# Altium schematic sheet TestMod_SEAx_Base.SchDoc
size A3
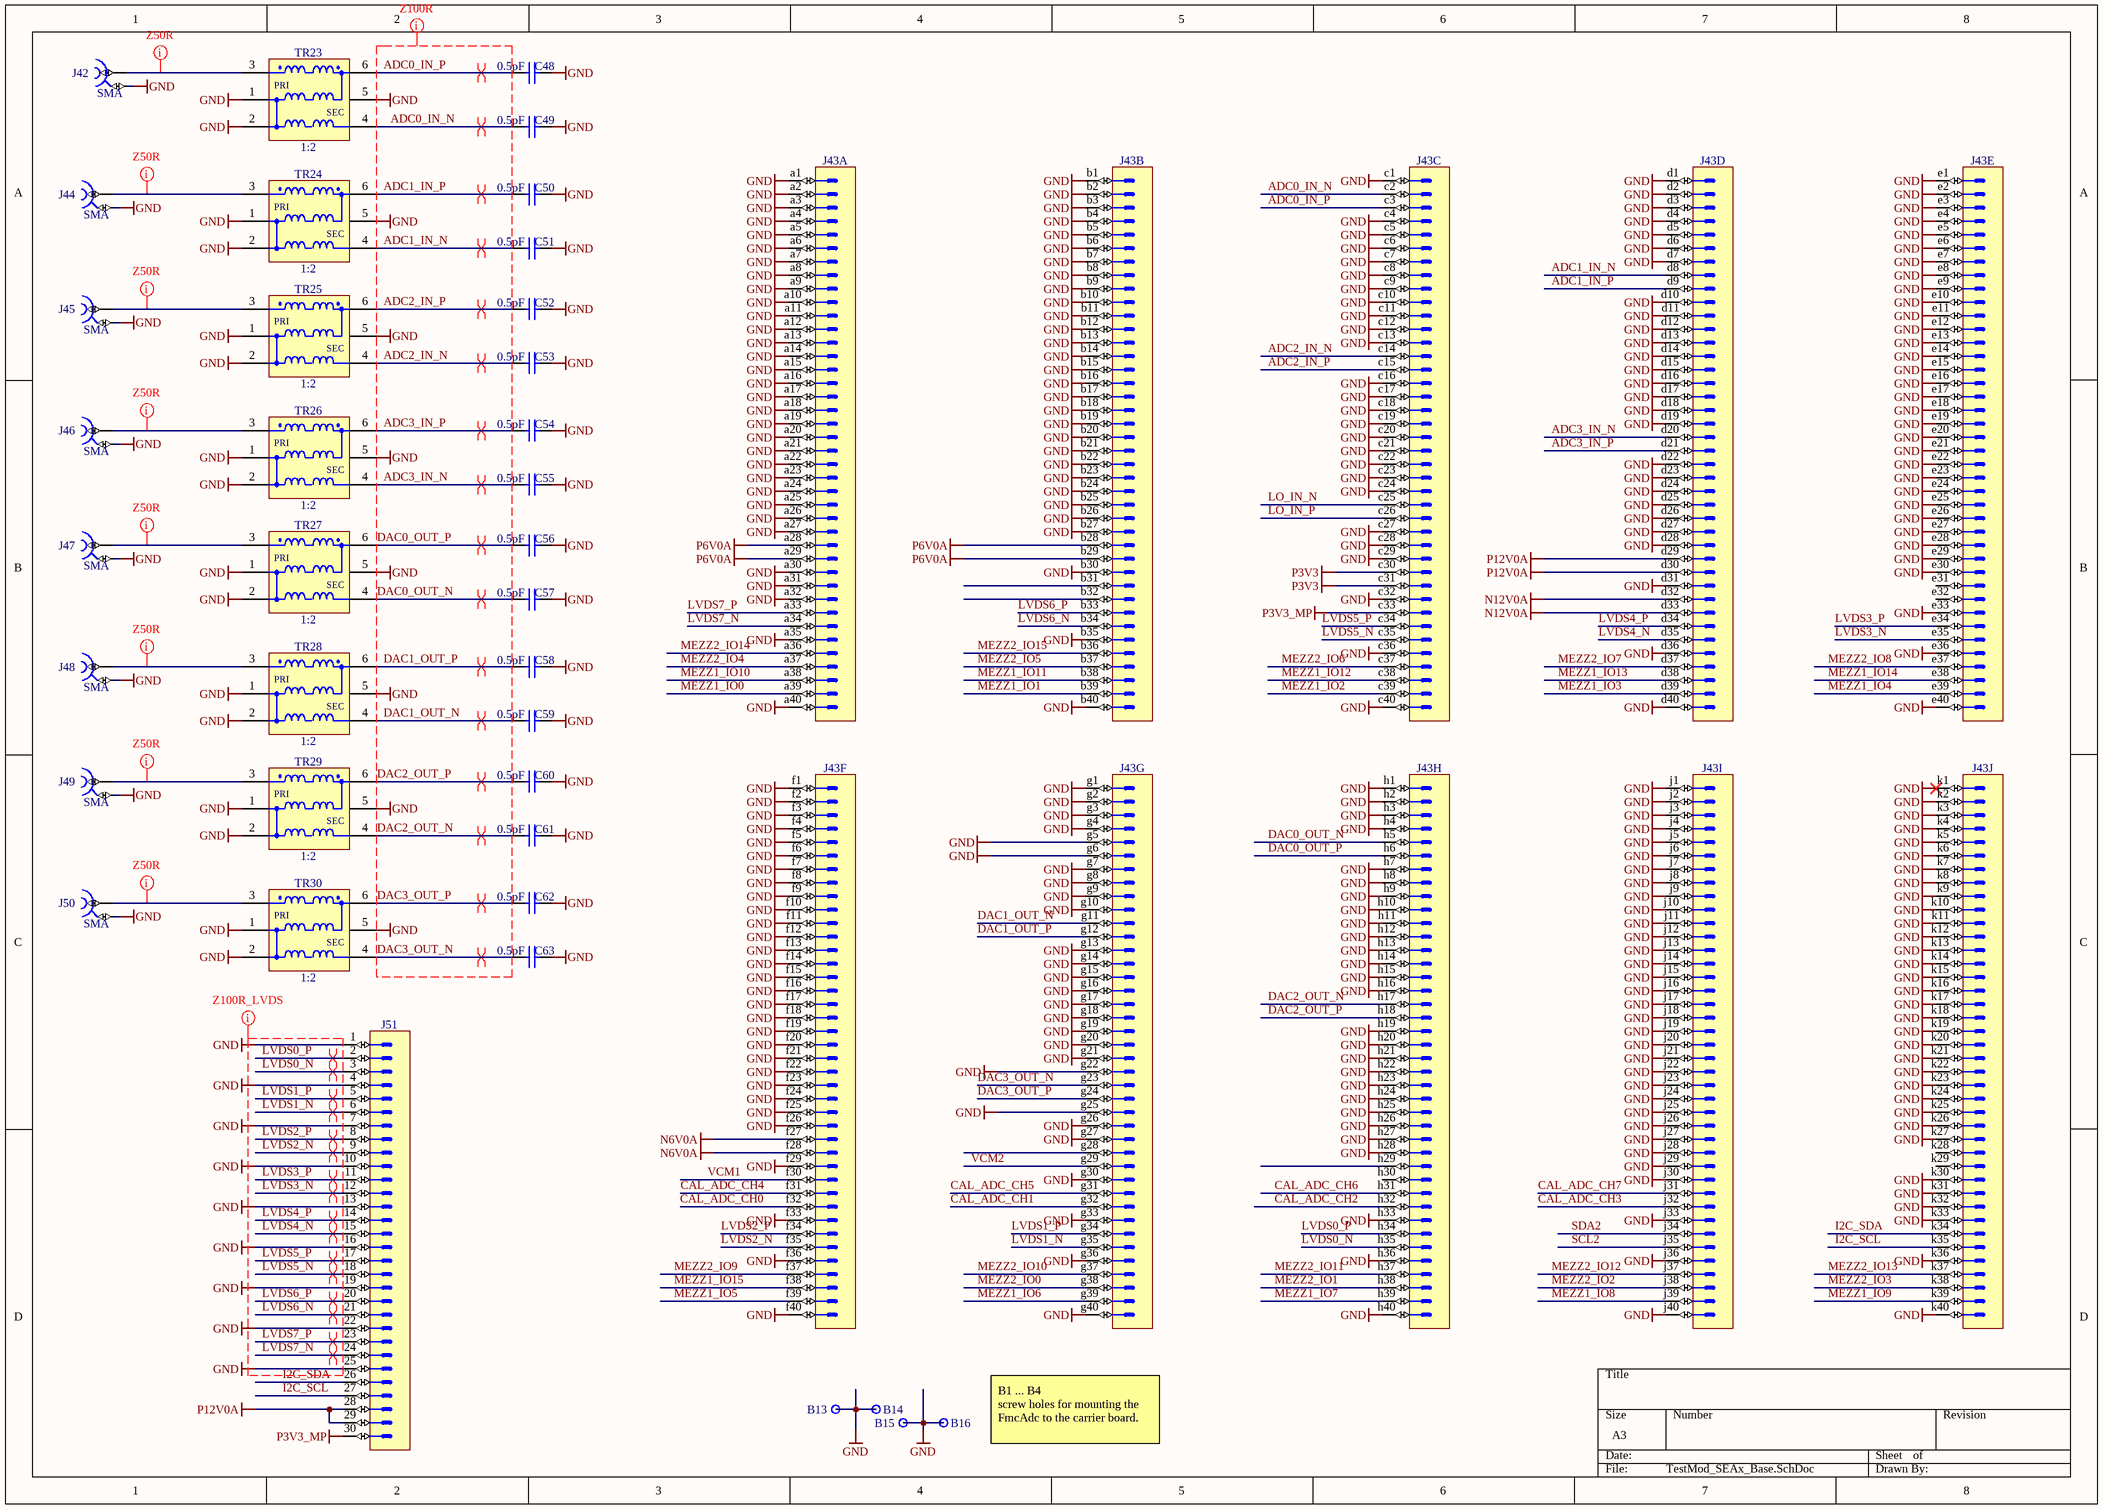
[diagram p0: TestMod_SEAx_Base.SchDoc]

## Parts
B13  Plated Hole  [MTG270_500]  (value not drawn)
B14  Plated Hole  [MTG270_500]  (value not drawn)
B15  Plated Hole  [MTG270_500]  (value not drawn)
B16  Plated Hole  [MTG270_500]  (value not drawn)
C48  0.5pF  [CAPC1005X50N]
C49  0.5pF  [CAPC1005X50N]
C50  0.5pF  [CAPC1005X50N]
C51  0.5pF  [CAPC1005X50N]
C52  0.5pF  [CAPC1005X50N]
C53  0.5pF  [CAPC1005X50N]
C54  0.5pF  [CAPC1005X50N]
C55  0.5pF  [CAPC1005X50N]
C56  0.5pF  [CAPC1005X50N]
C57  0.5pF  [CAPC1005X50N]
C58  0.5pF  [CAPC1005X50N]
C59  0.5pF  [CAPC1005X50N]
C60  0.5pF  [CAPC1005X50N]
C61  0.5pF  [CAPC1005X50N]
C62  0.5pF  [CAPC1005X50N]
C63  0.5pF  [CAPC1005X50N]
J42  SMA  [TYCO_5-1814832-1]
J43  VITA 57  [SAMTEC_ASP-134488-01]  (value not drawn)  (parts A,B,C,D,E,F,G,H,I,J of 10)
J44  SMA  [TYCO_5-1814832-1]
J45  SMA  [TYCO_5-1814832-1]
J46  SMA  [TYCO_5-1814832-1]
J47  SMA  [TYCO_5-1814832-1]
J48  SMA  [TYCO_5-1814832-1]
J49  SMA  [TYCO_5-1814832-1]
J50  SMA  [TYCO_5-1814832-1]
J51  (no value)  [3M_N2530-6002RB]
TR23  1:2  [XFMR_MINI-CIRCUITS_DB1627]
TR24  1:2  [XFMR_MINI-CIRCUITS_DB1627]
TR25  1:2  [XFMR_MINI-CIRCUITS_DB1627]
TR26  1:2  [XFMR_MINI-CIRCUITS_DB1627]
TR27  1:2  [XFMR_MINI-CIRCUITS_DB1627]
TR28  1:2  [XFMR_MINI-CIRCUITS_DB1627]
TR29  1:2  [XFMR_MINI-CIRCUITS_DB1627]
TR30  1:2  [XFMR_MINI-CIRCUITS_DB1627]

## Nets
GND: B13.1 B14.1 B15.1 B16.1 C48.2 C49.2 C50.2 C51.2 C52.2 C53.2 C54.2 C55.2 C56.2 C57.2 C58.2 C59.2 C60.2 C61.2 C62.2 C63.2 J42.2 J43.a1 J43.a2 J43.a3 J43.a4 J43.a5 J43.a6 J43.a7 J43.a8 J43.a9 J43.a10 J43.a11 J43.a12 J43.a13 J43.a14 J43.a15 J43.a16 J43.a17 J43.a18 J43.a19 J43.a20 J43.a21 J43.a22 J43.a23 J43.a24 J43.a25 J43.a26 J43.a27 J43.a30 J43.a31 J43.a32 J43.a35 J43.a40 J43.b1 J43.b2 J43.b3 J43.b4 J43.b5 J43.b6 J43.b7 J43.b8 J43.b9 J43.b10 J43.b11 J43.b12 J43.b13 J43.b14 J43.b15 J43.b16 J43.b17 J43.b18 J43.b19 J43.b20 J43.b21 J43.b22 J43.b23 J43.b24 J43.b25 J43.b26 J43.b27 J43.b30 J43.b35 J43.b40 J43.c1 J43.c4 J43.c5 J43.c6 J43.c7 J43.c8 J43.c9 J43.c10 J43.c11 J43.c12 J43.c13 J43.c16 J43.c17 J43.c18 J43.c19 J43.c20 J43.c21 J43.c22 J43.c23 J43.c24 J43.c27 J43.c28 J43.c29 J43.c32 J43.c36 J43.c40 J43.d1 J43.d2 J43.d3 J43.d4 J43.d5 J43.d6 J43.d7 J43.d10 J43.d11 J43.d12 J43.d13 J43.d14 J43.d15 J43.d16 J43.d17 J43.d18 J43.d19 J43.d22 J43.d23 J43.d24 J43.d25 J43.d26 J43.d27 J43.d28 J43.d31 J43.d36 J43.d40 J43.e1 J43.e2 J43.e3 J43.e4 J43.e5 J43.e6 J43.e7 J43.e8 J43.e9 J43.e10 J43.e11 J43.e12 J43.e13 J43.e14 J43.e15 J43.e16 J43.e17 J43.e18 J43.e19 J43.e20 J43.e21 J43.e22 J43.e23 J43.e24 J43.e25 J43.e26 J43.e27 J43.e28 J43.e29 J43.e30 J43.e33 J43.e36 J43.e40 J43.f1 J43.f2 J43.f3 J43.f4 J43.f5 J43.f6 J43.f7 J43.f8 J43.f9 J43.f10 J43.f11 J43.f12 J43.f13 J43.f14 J43.f15 J43.f16 J43.f17 J43.f18 J43.f19 J43.f20 J43.f21 J43.f22 J43.f23 J43.f24 J43.f25 J43.f26 J43.f29 J43.f33 J43.f36 J43.f40 J43.g1 J43.g2 J43.g3 J43.g4 J43.g5 J43.g6 J43.g7 J43.g8 J43.g9 J43.g10 J43.g13 J43.g14 J43.g15 J43.g16 J43.g17 J43.g18 J43.g19 J43.g20 J43.g21 J43.g22 J43.g25 J43.g26 J43.g27 J43.g30 J43.g33 J43.g36 J43.g40 J43.h1 J43.h2 J43.h3 J43.h4 J43.h7 J43.h8 J43.h9 J43.h10 J43.h11 J43.h12 J43.h13 J43.h14 J43.h15 J43.h16 J43.h19 J43.h20 J43.h21 J43.h22 J43.h23 J43.h24 J43.h25 J43.h26 J43.h27 J43.h28 J43.h33 J43.h36 J43.h40 J43.j1 J43.j2 J43.j3 J43.j4 J43.j5 J43.j6 J43.j7 J43.j8 J43.j9 J43.j10 J43.j11 J43.j12 J43.j13 J43.j14 J43.j15 J43.j16 J43.j17 J43.j18 J43.j19 J43.j20 J43.j21 J43.j22 J43.j23 J43.j24 J43.j25 J43.j26 J43.j27 J43.j28 J43.j29 J43.j30 J43.j33 J43.j36 J43.j40 J43.k1 J43.k2 J43.k3 J43.k4 J43.k5 J43.k6 J43.k7 J43.k8 J43.k9 J43.k10 J43.k11 J43.k12 J43.k13 J43.k14 J43.k15 J43.k16 J43.k17 J43.k18 J43.k19 J43.k20 J43.k21 J43.k22 J43.k23 J43.k24 J43.k25 J43.k26 J43.k27 J43.k30 J43.k31 J43.k32 J43.k33 J43.k36 J43.k40 J44.2 J45.2 J46.2 J47.2 J48.2 J49.2 J50.2 J51.1 J51.4 J51.7 J51.10 J51.13 J51.16 J51.19 J51.22 J51.25 TR23.1(P1) TR23.2(P1) TR23.5(NC) TR24.1(P1) TR24.2(P1) TR24.5(NC) TR25.1(P1) TR25.2(P1) TR25.5(NC) TR26.1(P1) TR26.2(P1) TR26.5(NC) TR27.1(P1) TR27.2(P1) TR27.5(NC) TR28.1(P1) TR28.2(P1) TR28.5(NC) TR29.1(P1) TR29.2(P1) TR29.5(NC) TR30.1(P1) TR30.2(P1) TR30.5(NC)
N6V0A: J43.f27 J43.f28
N12V0A: J43.d32 J43.d33
P3V3: J43.c30 J43.c31
P3V3_MP: J43.c33 J51.30
P6V0A: J43.a28 J43.a29 J43.b28 J43.b29
P12V0A: J43.d29 J43.d30 J51.28 J51.29
ADC0_IN_N: C49.1 J43.c2 TR23.4(S1)
ADC0_IN_P: C48.1 J43.c3 TR23.6(S1)
ADC1_IN_N: C51.1 J43.d8 TR24.4(S1)
ADC1_IN_P: C50.1 J43.d9 TR24.6(S1)
ADC2_IN_N: C53.1 J43.c14 TR25.4(S1)
ADC2_IN_P: C52.1 J43.c15 TR25.6(S1)
ADC3_IN_N: C55.1 J43.d20 TR26.4(S1)
ADC3_IN_P: C54.1 J43.d21 TR26.6(S1)
CAL_ADC_CH0: J43.f32
CAL_ADC_CH1: J43.g32
CAL_ADC_CH2: J43.h32
CAL_ADC_CH3: J43.j32
CAL_ADC_CH4: J43.f31
CAL_ADC_CH5: J43.g31
CAL_ADC_CH6: J43.h31
CAL_ADC_CH7: J43.j31
DAC0_OUT_N: C57.1 J43.h5 TR27.4(S1)
DAC0_OUT_P: C56.1 J43.h6 TR27.6(S1)
DAC1_OUT_N: C59.1 J43.g11 TR28.4(S1)
DAC1_OUT_P: C58.1 J43.g12 TR28.6(S1)
DAC2_OUT_N: C61.1 J43.h17 TR29.4(S1)
DAC2_OUT_P: C60.1 J43.h18 TR29.6(S1)
DAC3_OUT_N: C63.1 J43.g23 TR30.4(S1)
DAC3_OUT_P: C62.1 J43.g24 TR30.6(S1)
I2C_SCL: J43.k35 J51.27
I2C_SDA: J43.k34 J51.26
LO_IN_N: J43.c25
LO_IN_P: J43.c26
LVDS0_N: J43.h35 J51.3
LVDS0_P: J43.h34 J51.2
LVDS1_N: J43.g35 J51.6
LVDS1_P: J43.g34 J51.5
LVDS2_N: J43.f35 J51.9
LVDS2_P: J43.f34 J51.8
LVDS3_N: J43.e35 J51.12
LVDS3_P: J43.e34 J51.11
LVDS4_N: J43.d35 J51.15
LVDS4_P: J43.d34 J51.14
LVDS5_N: J43.c35 J51.18
LVDS5_P: J43.c34 J51.17
LVDS6_N: J43.b34 J51.21
LVDS6_P: J43.b33 J51.20
LVDS7_N: J43.a34 J51.24
LVDS7_P: J43.a33 J51.23
MEZZ1_IO0: J43.a39
MEZZ1_IO1: J43.b39
MEZZ1_IO2: J43.c39
MEZZ1_IO3: J43.d39
MEZZ1_IO4: J43.e39
MEZZ1_IO5: J43.f39
MEZZ1_IO6: J43.g39
MEZZ1_IO7: J43.h39
MEZZ1_IO8: J43.j39
MEZZ1_IO9: J43.k39
MEZZ1_IO10: J43.a38
MEZZ1_IO11: J43.b38
MEZZ1_IO12: J43.c38
MEZZ1_IO13: J43.d38
MEZZ1_IO14: J43.e38
MEZZ1_IO15: J43.f38
MEZZ2_IO0: J43.g38
MEZZ2_IO1: J43.h38
MEZZ2_IO2: J43.j38
MEZZ2_IO3: J43.k38
MEZZ2_IO4: J43.a37
MEZZ2_IO5: J43.b37
MEZZ2_IO6: J43.c37
MEZZ2_IO7: J43.d37
MEZZ2_IO8: J43.e37
MEZZ2_IO9: J43.f37
MEZZ2_IO10: J43.g37
MEZZ2_IO11: J43.h37
MEZZ2_IO12: J43.j37
MEZZ2_IO13: J43.k37
MEZZ2_IO14: J43.a36
MEZZ2_IO15: J43.b36
SCL2: J43.j35
SDA2: J43.j34
VCM1: J43.f30
VCM2: J43.g29
NetJ42_1: J42.1 TR23.3(P1)
NetJ44_1: J44.1 TR24.3(P1)
NetJ45_1: J45.1 TR25.3(P1)
NetJ46_1: J46.1 TR26.3(P1)
NetJ47_1: J47.1 TR27.3(P1)
NetJ48_1: J48.1 TR28.3(P1)
NetJ49_1: J49.1 TR29.3(P1)
NetJ50_1: J50.1 TR30.3(P1)

Not connected (* = marked no-connect by the designer): J43 b31 b32 e31 e32 g28 h29 h30 k28 k29

## Layout directives
differential pair: ADC0_IN_N, ADC0_IN_P, ADC1_IN_N, ADC1_IN_P, ADC2_IN_N, ADC2_IN_P, ADC3_IN_N, ADC3_IN_P, DAC0_OUT_N, DAC0_OUT_P, DAC1_OUT_N, DAC1_OUT_P, DAC2_OUT_N, DAC2_OUT_P, DAC3_OUT_N, DAC3_OUT_P, LVDS0_N, LVDS0_P, LVDS1_N, LVDS1_P, LVDS2_N, LVDS2_P, LVDS3_N, LVDS3_P, LVDS4_N, LVDS4_P, LVDS5_N, LVDS5_P, LVDS6_N, LVDS6_P, LVDS7_N, LVDS7_P
rule Impedance Constraint [Min = 49.00    Max = 51.00    ]; net class Z50R: NetJ42_1, NetJ44_1, NetJ45_1, NetJ46_1, NetJ47_1, NetJ48_1, NetJ49_1, NetJ50_1
rule Differential Pairs Routing [Pref Gap = 12mil    Min Gap  = 12mil    Max Gap  = 12milPref Width = 14mil    Min Width  = 14mil    Max Width  = 14mil]: ADC0_IN_N, ADC0_IN_P, ADC1_IN_N, ADC1_IN_P, ADC2_IN_N, ADC2_IN_P, ADC3_IN_N, ADC3_IN_P, DAC0_OUT_N, DAC0_OUT_P, DAC1_OUT_N, DAC1_OUT_P, DAC2_OUT_N, DAC2_OUT_P, DAC3_OUT_N, DAC3_OUT_P, GND
rule Differential Pairs Routing [Pref Gap = 6mil    Min Gap  = 6mil    Max Gap  = 6milPref Width = 11mil    Min Width  = 11mil    Max Width  = 11mil]: GND, LVDS0_N, LVDS0_P, LVDS1_N, LVDS1_P, LVDS2_N, LVDS2_P, LVDS3_N, LVDS3_P, LVDS4_N, LVDS4_P, LVDS5_N, LVDS5_P, LVDS6_N, LVDS6_P, LVDS7_N, LVDS7_P

## Notes on the sheet
- B1 ... B4
  screw holes for mounting the FmcAdc to the carrier board.
- (in symbol XFMR_MINI-CIRCUITS_TCM2-43X+) PRI; SEC

## Library data of the parts
B13-B16 = PLATED_HOLE2.7_PAD5.0: Single Terminal Socket; Part Description: Plated Through Hole: Hole Dia.=2.7mm Pad Dia.=5.0mm; Mounted: No; Part Number: PLATED_HOLE2.7_PAD5.0; Component Kind: Standard (No BOM); Component Type: Standard (No BOM); Pin Count: 1; Family: Plated Hole; Socket: No; SMD: No; Sense: No; Status: None; ComponentHeight: 0mm; HelpURL: Undefined; Author: CERN DEM JMW; CreateDate: 27.09.2011; LatestRevisionDate: 27.09.2011; PackageDescription: Plated Through Hole: Hole Dia.=2.7mm Pad Dia.=5.0mm
C48-C63 = CC0402_0.5PF_25V_0.05PF_AVX_04023J0R5ABSTR: Non-polarised capacitor; Part Description: Thin-Film Chip Capacitors for RF Signal and Power Applications, Accu-P Series; Manufacturer: AVX; Voltage: 25V; Tolerance: ±0.05pF; Part Number: CC0402_0.5PF_25V_0.05PF_AVX_04023J0R5ABSTR; Component Kind: Standard; Component Type: Standard; Pin Count: 2; Value: 0.5pF; Status: None; Manufacturer Part Number: 04023J0R5ABSTR; Case: 0402; Mounted: Yes; Socket: No; SMD: Yes; Sense: No; ComponentHeight: 0.5mm; HelpURL: \\cern.ch\dfs\Applications\Altium\Datasheets\CC0402_AVX_ACCU-P.pdf; Author: CERN DEM JLC; CreateDate: 22.02.2017; LatestRevisionDate: 22.02.2017
J42 J44-J50 = TYCO_5-1814832-1: Part Description: 50 Ohms SMA Straight PCB Die Socket; Manufacturer: TYCO ELECTRONICS; PressFit: No; Part Number: TYCO_5-1814832-1; Component Kind: Standard; Component Type: Standard; Pin Count: 2; Family: SMA; Mounted: Yes; Socket: No; SMD: No; Sense: No; Status: None; Manufacturer Part Number: 5-1814832-1; ComponentHeight: 13.5mm; HelpURL: \\cern.ch\dfs\Applications\Altium\Datasheets\TYCO_5-1814832-1.pdf; Author: CERN DEM JLC; CreateDate: 17.11.2009; LatestRevisionDate: 17.11.2009
J43 = SAMTEC_ASP-134488-01: Connector VITA 57, 400 Male contacts in 10 row abcdefghj; Part Description: 400 contacts (10 rows abcdefghj) Surface Mount Male Connector, VITA 57 (MC-HPC-10); Manufacturer: SAMTEC; Part Number: SAMTEC_ASP-134488-01; Component Kind: Standard; Component Type: Standard; Pin Count: 400; Family: VITA 57; Mounted: Yes; Socket: No; SMD: Yes; Status: None; Manufacturer Part Number: ASP-134488-01; ComponentHeight: 6.1mm; HelpURL: \\cern.ch\dfs\Applications\Altium\Datasheets\SAMTEC_ASP-134488-01.pdf; Author: CERN DEM JLC; CreateDate: 30/04/2009; LatestRevisionDate: 17/08/2009; Table: SAMTEC
J51 = 3M_N2530-6002RB: Connector 30 Male; Part Description: 30 Contacts - Straight .100'' x .100'' Low Profile Four-Wall Header, 2500 Series; Manufacturer: 3M; PressFit: No; Part Number: 3M_N2530-6002RB; Component Kind: Standard; Component Type: Standard; Pin Count: 30; Family: Header 30; Mounted: Yes; Socket: No; SMD: No; Sense: No; Status: None; Manufacturer Part Number: N2530-6002RB; ComponentHeight: 10.03mm; HelpURL: \\cern.ch\dfs\Applications\Altium\Datasheets\3M_N2530-6002RB.pdf; Author: CERN DEM JLC; CreateDate: 11.02.2009; LatestRevisionDate: 11.08.2009
TR23-TR30 = XFMR_MINI-CIRCUITS_TCM2-43X+: 50 OHMS 10 to 4000 MHz RF Transformer; Power: 0.4W; Part Number: XFMR_MINI-CIRCUITS_TCM2-43X+; Component Kind: Standard; Component Type: Standard; Pin Count: 6; Value: 1:2; Status: None; Part Description: 50 Ohms 10 to 4000MHz RF Transformer; Manufacturer: MINI-CIRCUITS; Manufacturer Part Number: TCM2-43X+; Mounted: Yes; Socket: No; Sense: No; SMD: Yes; ComponentHeight: 4.06mm; HelpURL: \\cern.ch\dfs\Applications\Altium\Datasheets\XFMR_MINI-CIRCUITS_TCM2-43X+.pdf; Author: CERN DEM BC; CreateDate: 12.02.2016; LatestRevisionDate: 12.02.2016